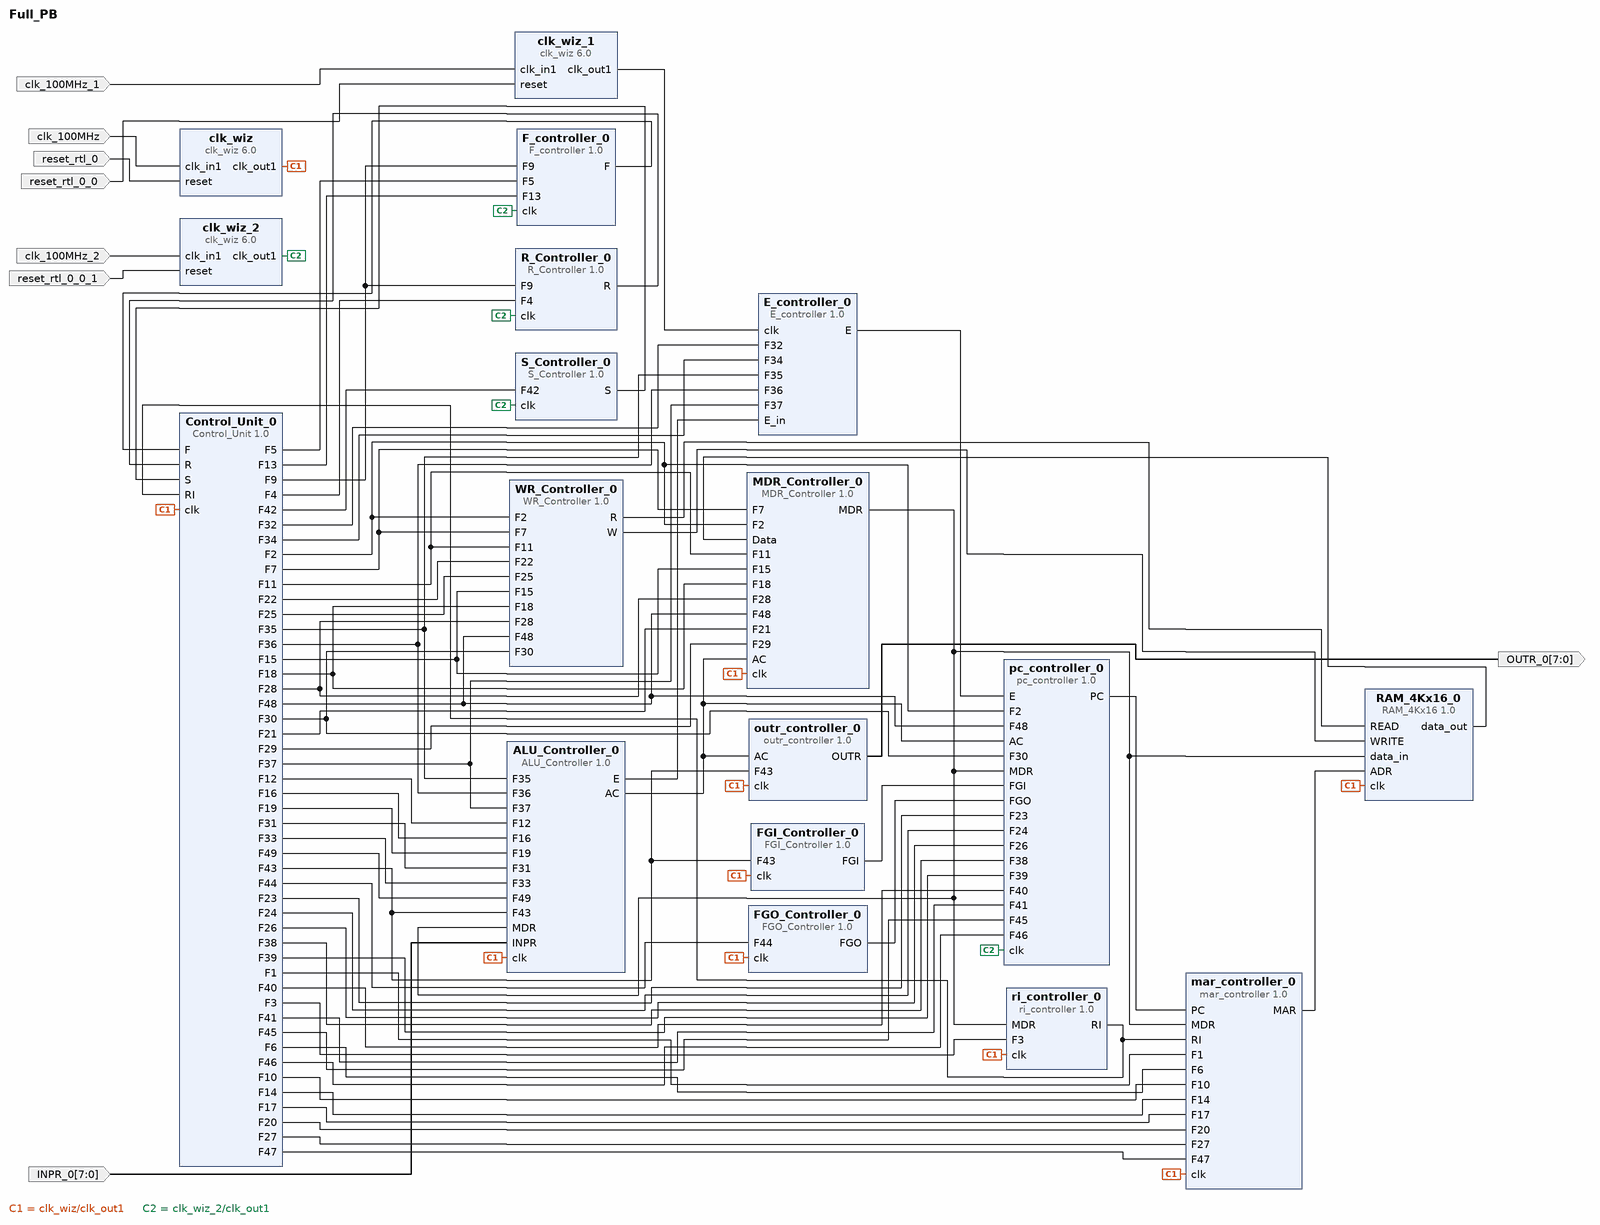
[diagram p0: block diagram of the top level]
# Vivado block design Full_PB, xc7z020clg400-1, Vivado 2022.2
create_bd_design Full_PB

create_bd_port -dir I -type clk clk_100MHz
set_property -dict {CONFIG.FREQ_HZ 100000000} [get_bd_ports clk_100MHz]
create_bd_port -dir I -type rst reset_rtl_0
set_property -dict {CONFIG.POLARITY ACTIVE_HIGH} [get_bd_ports reset_rtl_0]
create_bd_port -dir I -type clk clk_100MHz_1
set_property -dict {CONFIG.FREQ_HZ 100000000} [get_bd_ports clk_100MHz_1]
create_bd_port -dir I -type rst reset_rtl_0_0
set_property -dict {CONFIG.POLARITY ACTIVE_HIGH} [get_bd_ports reset_rtl_0_0]
create_bd_port -dir I -type clk clk_100MHz_2
set_property -dict {CONFIG.FREQ_HZ 100000000} [get_bd_ports clk_100MHz_2]
create_bd_port -dir I -type rst reset_rtl_0_0_1
set_property -dict {CONFIG.POLARITY ACTIVE_HIGH} [get_bd_ports reset_rtl_0_0_1]
create_bd_port -dir I -from 7 -to 0 INPR_0
create_bd_port -dir O -from 7 -to 0 OUTR_0

create_bd_cell -type ip -vlnv xilinx.com:user:mar_controller:1.0 mar_controller_0
create_bd_cell -type ip -vlnv xilinx.com:user:Control_Unit:1.0 Control_Unit_0
create_bd_cell -type ip -vlnv xilinx.com:user:MDR_Controller:1.0 MDR_Controller_0
create_bd_cell -type ip -vlnv xilinx.com:user:F_controller:1.0 F_controller_0
create_bd_cell -type ip -vlnv xilinx.com:user:S_Controller:1.0 S_Controller_0
create_bd_cell -type ip -vlnv xilinx.com:user:WR_Controller:1.0 WR_Controller_0
create_bd_cell -type ip -vlnv xilinx.com:user:ALU_Controller:1.0 ALU_Controller_0
create_bd_cell -type ip -vlnv xilinx.com:user:outr_controller:1.0 outr_controller_0
create_bd_cell -type ip -vlnv xilinx.com:user:ri_controller:1.0 ri_controller_0
create_bd_cell -type ip -vlnv xilinx.com:user:pc_controller:1.0 pc_controller_0
create_bd_cell -type ip -vlnv xilinx.com:user:FGI_Controller:1.0 FGI_Controller_0
create_bd_cell -type ip -vlnv xilinx.com:user:FGO_Controller:1.0 FGO_Controller_0
create_bd_cell -type ip -vlnv xilinx.com:user:E_controller:1.0 E_controller_0
create_bd_cell -type ip -vlnv xilinx.com:ip:clk_wiz:6.0 clk_wiz
create_bd_cell -type ip -vlnv xilinx.com:ip:clk_wiz:6.0 clk_wiz_1
create_bd_cell -type ip -vlnv xilinx.com:ip:clk_wiz:6.0 clk_wiz_2
create_bd_cell -type ip -vlnv xilinx.com:user:R_Controller:1.0 R_Controller_0
create_bd_cell -type ip -vlnv xilinx.com:user:RAM_4Kx16:1.0 RAM_4Kx16_0

# ---- connections ----

connect_bd_net [get_bd_pins ALU_Controller_0/AC] [get_bd_pins outr_controller_0/AC] [get_bd_pins pc_controller_0/AC] [get_bd_pins MDR_Controller_0/AC]
connect_bd_net [get_bd_pins ALU_Controller_0/E] [get_bd_pins E_controller_0/E_in]
connect_bd_net [get_bd_pins Control_Unit_0/F1] [get_bd_pins mar_controller_0/F1]
connect_bd_net [get_bd_pins Control_Unit_0/F2] [get_bd_pins MDR_Controller_0/F2] [get_bd_pins WR_Controller_0/F2] [get_bd_pins pc_controller_0/F2]
connect_bd_net [get_bd_pins Control_Unit_0/F3] [get_bd_pins ri_controller_0/F3]
connect_bd_net [get_bd_pins Control_Unit_0/F4] [get_bd_pins R_Controller_0/F4]
connect_bd_net [get_bd_pins Control_Unit_0/F5] [get_bd_pins F_controller_0/F5]
connect_bd_net [get_bd_pins Control_Unit_0/F6] [get_bd_pins mar_controller_0/F6]
connect_bd_net [get_bd_pins Control_Unit_0/F7] [get_bd_pins MDR_Controller_0/F7] [get_bd_pins WR_Controller_0/F7]
connect_bd_net [get_bd_pins Control_Unit_0/F9] [get_bd_pins F_controller_0/F9] [get_bd_pins R_Controller_0/F9]
connect_bd_net [get_bd_pins Control_Unit_0/F10] [get_bd_pins mar_controller_0/F10]
connect_bd_net [get_bd_pins Control_Unit_0/F11] [get_bd_pins MDR_Controller_0/F11] [get_bd_pins WR_Controller_0/F11]
connect_bd_net [get_bd_pins Control_Unit_0/F12] [get_bd_pins ALU_Controller_0/F12]
connect_bd_net [get_bd_pins Control_Unit_0/F13] [get_bd_pins F_controller_0/F13]
connect_bd_net [get_bd_pins Control_Unit_0/F14] [get_bd_pins mar_controller_0/F14]
connect_bd_net [get_bd_pins Control_Unit_0/F15] [get_bd_pins MDR_Controller_0/F15] [get_bd_pins WR_Controller_0/F15]
connect_bd_net [get_bd_pins Control_Unit_0/F16] [get_bd_pins ALU_Controller_0/F16]
connect_bd_net [get_bd_pins Control_Unit_0/F17] [get_bd_pins mar_controller_0/F17]
connect_bd_net [get_bd_pins Control_Unit_0/F18] [get_bd_pins MDR_Controller_0/F18] [get_bd_pins WR_Controller_0/F18]
connect_bd_net [get_bd_pins Control_Unit_0/F19] [get_bd_pins ALU_Controller_0/F19]
connect_bd_net [get_bd_pins Control_Unit_0/F20] [get_bd_pins mar_controller_0/F20]
connect_bd_net [get_bd_pins Control_Unit_0/F21] [get_bd_pins MDR_Controller_0/F21]
connect_bd_net [get_bd_pins Control_Unit_0/F22] [get_bd_pins WR_Controller_0/F22]
connect_bd_net [get_bd_pins Control_Unit_0/F23] [get_bd_pins pc_controller_0/F23]
connect_bd_net [get_bd_pins Control_Unit_0/F24] [get_bd_pins pc_controller_0/F24]
connect_bd_net [get_bd_pins Control_Unit_0/F25] [get_bd_pins WR_Controller_0/F25]
connect_bd_net [get_bd_pins Control_Unit_0/F26] [get_bd_pins pc_controller_0/F26]
connect_bd_net [get_bd_pins Control_Unit_0/F27] [get_bd_pins mar_controller_0/F27]
connect_bd_net [get_bd_pins Control_Unit_0/F28] [get_bd_pins MDR_Controller_0/F28] [get_bd_pins WR_Controller_0/F28]
connect_bd_net [get_bd_pins Control_Unit_0/F29] [get_bd_pins MDR_Controller_0/F29]
connect_bd_net [get_bd_pins Control_Unit_0/F30] [get_bd_pins WR_Controller_0/F30] [get_bd_pins pc_controller_0/F30]
connect_bd_net [get_bd_pins Control_Unit_0/F31] [get_bd_pins ALU_Controller_0/F31]
connect_bd_net [get_bd_pins Control_Unit_0/F32] [get_bd_pins E_controller_0/F32]
connect_bd_net [get_bd_pins Control_Unit_0/F33] [get_bd_pins ALU_Controller_0/F33]
connect_bd_net [get_bd_pins Control_Unit_0/F34] [get_bd_pins E_controller_0/F34]
connect_bd_net [get_bd_pins Control_Unit_0/F35] [get_bd_pins ALU_Controller_0/F35] [get_bd_pins E_controller_0/F35]
connect_bd_net [get_bd_pins Control_Unit_0/F36] [get_bd_pins ALU_Controller_0/F36] [get_bd_pins E_controller_0/F36]
connect_bd_net [get_bd_pins Control_Unit_0/F37] [get_bd_pins ALU_Controller_0/F37] [get_bd_pins E_controller_0/F37]
connect_bd_net [get_bd_pins Control_Unit_0/F38] [get_bd_pins pc_controller_0/F38]
connect_bd_net [get_bd_pins Control_Unit_0/F39] [get_bd_pins pc_controller_0/F39]
connect_bd_net [get_bd_pins Control_Unit_0/F40] [get_bd_pins pc_controller_0/F40]
connect_bd_net [get_bd_pins Control_Unit_0/F41] [get_bd_pins pc_controller_0/F41]
connect_bd_net [get_bd_pins Control_Unit_0/F42] [get_bd_pins S_Controller_0/F42]
connect_bd_net [get_bd_pins Control_Unit_0/F43] \
  [get_bd_pins ALU_Controller_0/F43] [get_bd_pins outr_controller_0/F43] [get_bd_pins FGI_Controller_0/F43]
connect_bd_net [get_bd_pins Control_Unit_0/F44] [get_bd_pins FGO_Controller_0/F44]
connect_bd_net [get_bd_pins Control_Unit_0/F45] [get_bd_pins pc_controller_0/F45]
connect_bd_net [get_bd_pins Control_Unit_0/F46] [get_bd_pins pc_controller_0/F46]
connect_bd_net [get_bd_pins Control_Unit_0/F47] [get_bd_pins mar_controller_0/F47]
connect_bd_net [get_bd_pins Control_Unit_0/F48] [get_bd_pins MDR_Controller_0/F48] [get_bd_pins WR_Controller_0/F48] [get_bd_pins pc_controller_0/F48]
connect_bd_net [get_bd_pins Control_Unit_0/F49] [get_bd_pins ALU_Controller_0/F49]
connect_bd_net [get_bd_pins E_controller_0/E] [get_bd_pins pc_controller_0/E]
connect_bd_net [get_bd_pins FGI_Controller_0/FGI] [get_bd_pins pc_controller_0/FGI]
connect_bd_net [get_bd_pins FGO_Controller_0/FGO] [get_bd_pins pc_controller_0/FGO]
connect_bd_net [get_bd_pins F_controller_0/F] [get_bd_pins Control_Unit_0/F]
connect_bd_net -net INPR_0_1 [get_bd_ports INPR_0] [get_bd_pins ALU_Controller_0/INPR]
connect_bd_net [get_bd_pins MDR_Controller_0/MDR] \
  [get_bd_pins ALU_Controller_0/MDR] [get_bd_pins mar_controller_0/MDR] [get_bd_pins ri_controller_0/MDR] \
  [get_bd_pins pc_controller_0/MDR] [get_bd_pins RAM_4Kx16_0/data_in]
connect_bd_net [get_bd_pins clk_wiz/clk_out1] \
  [get_bd_pins Control_Unit_0/clk] [get_bd_pins mar_controller_0/clk] [get_bd_pins MDR_Controller_0/clk] \
  [get_bd_pins ALU_Controller_0/clk] [get_bd_pins ri_controller_0/clk] [get_bd_pins outr_controller_0/clk] \
  [get_bd_pins FGI_Controller_0/clk] [get_bd_pins FGO_Controller_0/clk] [get_bd_pins RAM_4Kx16_0/clk]
connect_bd_net [get_bd_pins clk_wiz_2/clk_out1] \
  [get_bd_pins F_controller_0/clk] [get_bd_pins S_Controller_0/clk] [get_bd_pins pc_controller_0/clk] \
  [get_bd_pins R_Controller_0/clk]
connect_bd_net [get_bd_pins RAM_4Kx16_0/data_out] [get_bd_pins MDR_Controller_0/Data]
connect_bd_net [get_bd_pins R_Controller_0/R] [get_bd_pins Control_Unit_0/R]
connect_bd_net [get_bd_pins S_Controller_0/S] [get_bd_pins Control_Unit_0/S]
connect_bd_net [get_bd_pins WR_Controller_0/R] [get_bd_pins RAM_4Kx16_0/READ]
connect_bd_net [get_bd_pins WR_Controller_0/W] [get_bd_pins RAM_4Kx16_0/WRITE]
connect_bd_net [get_bd_ports clk_100MHz] [get_bd_pins clk_wiz/clk_in1]
connect_bd_net -net clk_100MHz_1_1 [get_bd_ports clk_100MHz_1] [get_bd_pins clk_wiz_1/clk_in1]
connect_bd_net -net clk_100MHz_2_1 [get_bd_ports clk_100MHz_2] [get_bd_pins clk_wiz_2/clk_in1]
connect_bd_net [get_bd_pins clk_wiz_1/clk_out1] [get_bd_pins E_controller_0/clk]
connect_bd_net [get_bd_pins mar_controller_0/MAR] [get_bd_pins RAM_4Kx16_0/ADR]
connect_bd_net [get_bd_pins outr_controller_0/OUTR] [get_bd_ports OUTR_0]
connect_bd_net [get_bd_pins pc_controller_0/PC] [get_bd_pins mar_controller_0/PC]
connect_bd_net -net reset_rtl_0_0_1 [get_bd_ports reset_rtl_0_0] [get_bd_pins clk_wiz_1/reset]
connect_bd_net -net reset_rtl_0_0_1_1 [get_bd_ports reset_rtl_0_0_1] [get_bd_pins clk_wiz_2/reset]
connect_bd_net -net reset_rtl_0_1 [get_bd_ports reset_rtl_0] [get_bd_pins clk_wiz/reset]
connect_bd_net [get_bd_pins ri_controller_0/RI] [get_bd_pins mar_controller_0/RI] [get_bd_pins Control_Unit_0/RI]

validate_bd_design
save_bd_design
